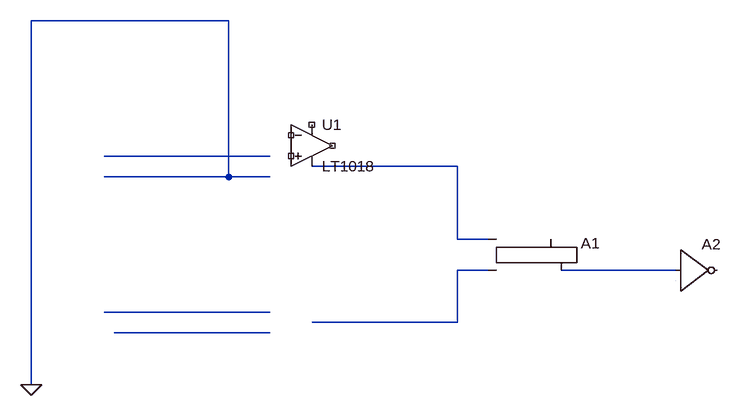
[diagram p0: schematic Draft3.asc]
Draft3.asc, the LTspice schematic file:
Version 4
SHEET 1 880 680
WIRE -144 -192 -448 -192
WIRE -80 16 -336 16
WIRE 208 32 -16 32
WIRE -144 48 -144 -192
WIRE -144 48 -336 48
WIRE -80 48 -144 48
WIRE 208 144 208 32
WIRE 256 144 208 144
WIRE 256 192 208 192
WIRE 544 192 368 192
WIRE -80 256 -336 256
WIRE 208 272 208 192
WIRE 208 272 -16 272
WIRE -80 288 -320 288
WIRE -448 368 -448 -192
FLAG -448 368 0
SYMBOL Digital\\srflop 304 96 R0
SYMATTR InstName A1
SYMBOL Digital\\inv 544 128 R0
SYMATTR InstName A2
SYMBOL Comparators\\LT1018 -16 0 R0
SYMATTR InstName U1

The netlist it stands for:
* Draft3.asc
A1 N002 N003 0 0 0 N004 0 0 SRFLOP
A2 N004 0 0 0 0 0 0 0 BUF
XU1 NC_01 NC_02 NC_03 N002 NC_04 LT1018  ; pins In+ In- V+ V- OUT
.lib LTC1.lib
.backanno
.end